# EAGLE design headphone_vu_schematic (EAGLE 7.2.0)
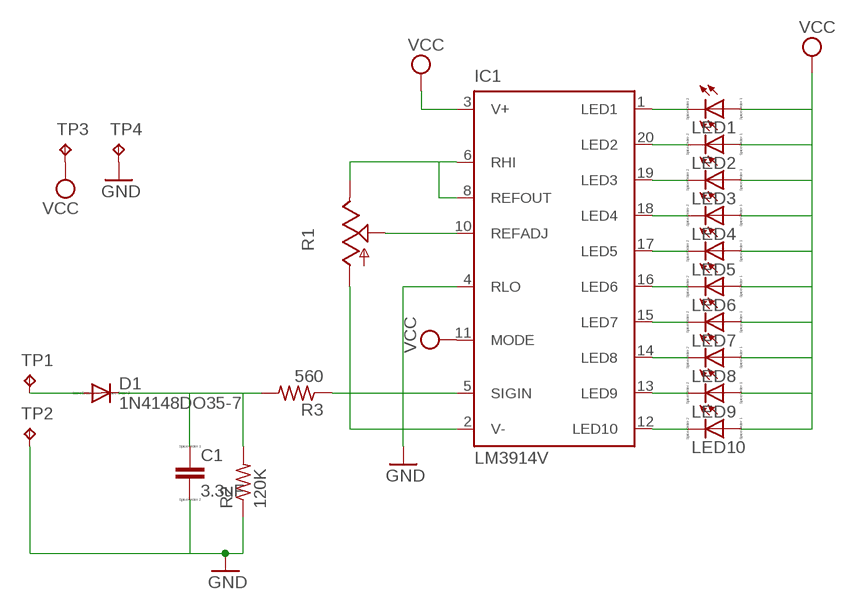
[diagram p0: schematic, sheet 1]

## Parts
C1  3.3uF  CC0603  [C0603]
D1  1N4148DO35-7  [DO35-7]
IC1  LM3914V  [PLCC20S]
LED1  LED_E  [LED_1206]
LED2  LED_E  [LED_1206]
LED3  LED_E  [LED_1206]
LED4  LED_E  [LED_1206]
LED5  LED_E  [LED_1206]
LED6  LED_E  [LED_1206]
LED7  LED_E  [LED_1206]
LED8  LED_E  [LED_1206]
LED9  LED_E  [LED_1206]
LED10  LED_E  [LED_1206]
R1  TRIM_US-3223W  [3223W]
R2  120K  R-US_R0603  [R0603]
R3  560  R-US_R0603  [R0603]
TP1  TPPAD1-20  [P1-20]
TP2  TPPAD1-20  [P1-20]
TP3  TPPAD1-20  [P1-20]
TP4  TPPAD1-20  [P1-20]

## Nets
GND: C1.2 IC1.2(V-) IC1.4(RLO) R1.1(A) R2.1 TP2.TP TP4.TP
N$1: IC1.1(LED1) LED1.C
N$2: IC1.20(LED2) LED2.C
N$3: IC1.19(LED3) LED3.C
N$4: IC1.18(LED4) LED4.C
N$5: IC1.17(LED5) LED5.C
N$6: IC1.16(LED6) LED6.C
N$7: IC1.15(LED7) LED7.C
N$8: IC1.14(LED8) LED8.C
N$9: IC1.13(LED9) LED9.C
N$10: IC1.12(LED10) LED10.C
N$11: IC1.6(RHI) IC1.8(REFOUT) R1.3(E)
N$12: IC1.10(REFADJ) R1.2(S)
N$13: C1.1 D1.C R2.2 R3.2
N$15: IC1.5(SIGIN) R3.1
N$16: D1.A TP1.TP
VCC: IC1.3(V+) IC1.11(MODE) LED1.A LED2.A LED3.A LED4.A LED5.A LED6.A LED7.A LED8.A LED9.A LED10.A TP3.TP

## Library data of the parts
C1 = eagle-ltspice:C: CAPACITOR, European symbol; SPICEMODEL: NONE; SPICEPREFIX: C
D1 = diode:1N4148: DIODE high speed (Philips)
IC1 = national-semiconductor:LM391: Dot/Bar Display Driver Source: Data sheet LM3915 <http://www.national.com/ds/LM/LM3915.pdf> Data sheet LM3914 <http://www.national.com/ds/LM/LM3914.pdf>
LED1-LED10 = eagle-ltspice:LED_E: LED Source: http://www.osram.convergy.de Source: www.luxeon.com Source: www.kingbright.com; SPICEMODEL: NONE; SPICEPREFIX: D; SPICETYPE: diode
R1 = pot:TRIM_US-: POTENTIOMETER
R2 R3 = resistor:R-US_: RESISTOR, American symbol
TP1-TP4 = testpad:TP: Test pad

## Board
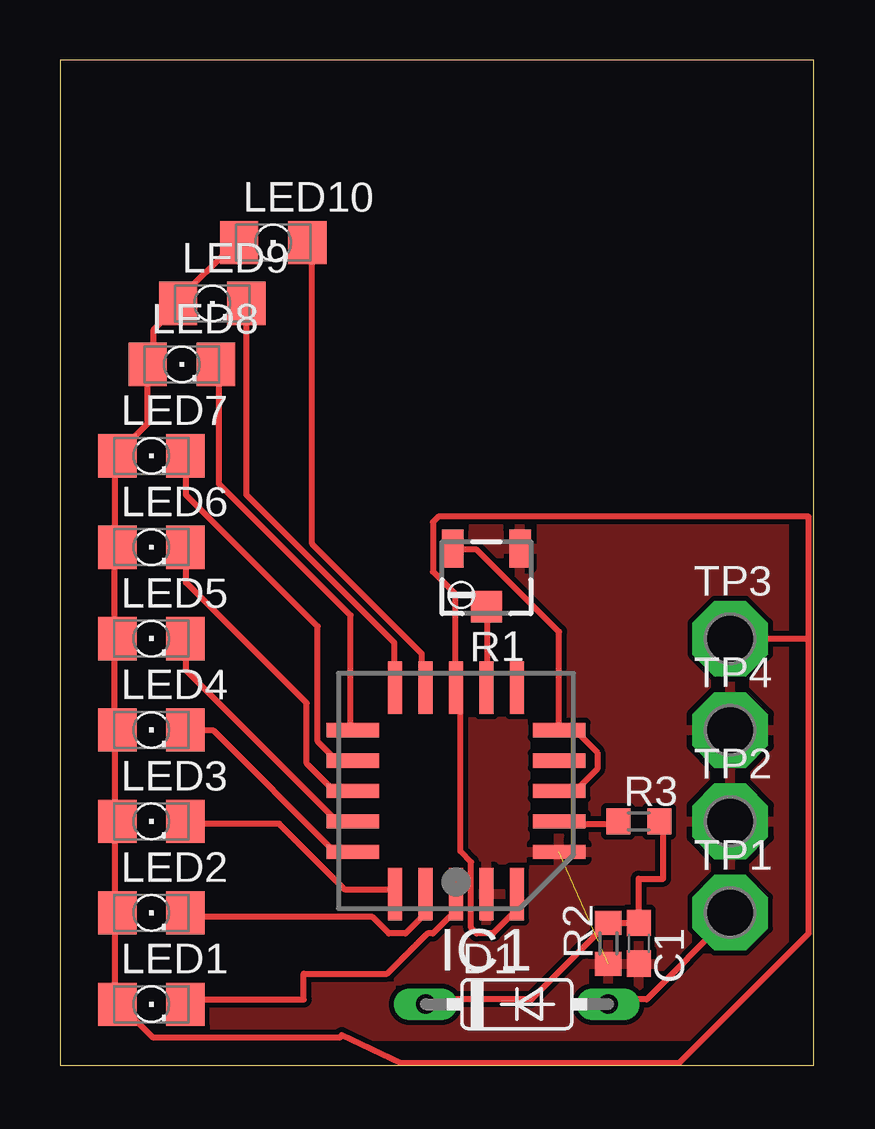
[diagram p1: board, top side]

Size 31.42 x 41.9 mm. Coordinates in mm from the lower left corner, seen from the top.
Outline: 0,0 31.42,0 31.42,41.9 0,41.9 0,0
Copper layers (1*16): Top 0.035mm / dielectric 1.5mm / Bottom 0.035mm
Design rules "default": minimum track width 10mil, minimum drill 24mil, track to track 8mil, track to pad 8mil, pad to pad 8mil, via to via 8mil, smd to smd 8mil, copper to edge 40mil, drill to drill 8mil, minimum pad ring 10mil, minimum via ring 8mil, stop-mask expansion 4mil, vias tented up to drill 0mil, thermal gap 10mil

### Footprints (pad centres in the part's own frame; a part is rotated, then mirrored left to right if it is on the bottom)
C0603 = smd 1.1 x 1: 1 -0.85,0; 2 0.85,0
DO35-7 = drill 0.813 long: A 3.81,0; C -3.81,0
PLCC20S = smd 0.6 x 2.2: 1 0,4.3; 2 -1.27,4.3; 3 -2.54,4.3; 9 -2.54,-4.3; 10 -1.27,-4.3; 11 0,-4.3; 12 1.27,-4.3; 13 2.54,-4.3; 19 2.54,4.3; 20 1.27,4.3 | smd 2.2 x 0.6: 4 -4.3,2.54; 5 -4.3,1.27; 6 -4.3,0; 7 -4.3,-1.27; 8 -4.3,-2.54; 14 4.3,-2.54; 15 4.3,-1.27; 16 4.3,0; 17 4.3,1.27; 18 4.3,2.54
LED_1206 = smd 1.6 x 1.803: A -1.422,0; C 1.422,0
3223W = smd 0.9 x 1.6: 1 -1.4,-1.215; 3 1.4,-1.215 | smd 1.3 x 1.3: 2 0,1.215
R0603 = smd 1 x 1.1: 1 -0.85,0; 2 0.85,0
P1-20 = drill 2.007 pad 3.15 octagon: TP 0,0

### Placement (x,y rotation side)
C1  24.13,5.08 270 top
D1  19.05,2.54 0 top
IC1  16.51,11.43 180 top
LED1  3.81,2.54 0 top
LED2  3.81,6.35 0 top
LED3  3.81,10.16 0 top
LED4  3.81,13.97 0 top
LED5  3.81,17.78 0 top
LED6  3.81,21.59 0 top
LED7  3.81,25.4 0 top
LED8  5.08,29.21 0 top
LED9  6.35,31.75 0 top
LED10  8.89,34.29 0 top
R1  17.78,20.32 180 top
R2  22.86,5.08 90 top
R3  24.13,10.16 0 top
TP1  27.94,6.35 0 top
TP2  27.94,10.16 0 top
TP3  27.94,17.78 0 top
TP4  27.94,13.97 0 top

### Tracks (layer width: path | path; a pad name or v marks a point on that pad's centre or on a via)
GND  (1 unrouted)
  pour Top: 0,0 0,24.13 arc-67 10.16,39.37 13.97,39.37 13.97,24.13 30.48,24.13 30.48,0
N$1
  Top 0.254: LED1.C 5.26,2.74 10.16,2.74 10.16,3.81 13.64,3.81 15.32,5.49 15.54,5.49 16.46,6.4 16.46,7.09 IC1.1
N$2
  Top 0.254: LED2.C 5.26,6.17 13.03,6.17 13.72,5.49 14.4,5.49 15.09,6.17 15.09,7.09 IC1.20
N$3
  Top 0.254: LED3.C 5.26,10.06 9.14,10.06 11.89,7.32 13.95,7.32 IC1.19
N$4
  Top 0.254: LED4.C 5.26,13.95 6.4,13.95 11.43,8.91 12.12,8.91 IC1.18
N$5
  Top 0.254: LED5.C 5.26,17.6 5.26,16.46 11.43,10.29 12.12,10.29 IC1.17
N$6
  Top 0.254: IC1.16 11.43,11.43 10.29,12.57 10.29,15.09 5.26,20.12 5.26,21.49 LED6.C
N$7
  Top 0.254: LED7.C 5.26,25.38 5.26,23.77 10.74,18.29 10.74,13.49 11.43,12.8 12.12,12.8 IC1.15
N$8
  Top 0.254: LED8.C 6.63,29.03 6.63,24.23 12.12,18.75 12.12,14.17 IC1.14
N$9
  Top 0.254: LED9.C 7.77,31.55 7.77,23.77 13.95,17.6 13.95,15.77 IC1.13
N$10
  Top 0.254: LED10.C 10.52,34.29 10.52,21.72 15.09,17.14 15.09,15.77 IC1.12
N$11
  Top 0.254: R1.3 16.46,21.49 17.37,21.49 20.8,18.06 20.8,14.17 IC1.8 21.03,13.95 21.49,13.95 22.4,13.03 22.4,12.34 21.49,11.43 IC1.6
N$12
  Top 0.254: R1.2 17.83,18.97 17.83,15.77 IC1.10
N$13
  Top 0.254: D1.C 15.32,2.74 19.66,2.74 22.86,5.94 R2.2 C1.1 24.13,7.77 25.15,7.77 25.15,10.06 R3.2
N$15
  Top 0.254: R3.1 23.09,10.06 21.03,10.06 IC1.5
N$16
  Top 0.254: D1.A 22.86,2.74 24.46,2.74 27.89,6.17 TP1.TP
VCC
  Top 0.254: IC1.3 18.97,7.09 18.97,6.4 18.06,5.49 17.37,5.49 17.14,5.71 17.14,8.46 16.69,8.91 16.69,15.54 IC1.11 16.46,15.77 16.46,19.66 15.54,20.57 15.54,22.63 15.77,22.86 31.22,22.86 31.22,17.78 | LED10.A 7.32,34.29 4.8,31.77 LED9.A 4.8,31.55 3.89,30.63 3.89,29.26 LED8.A 3.66,29.03 3.66,26.75 2.52,25.6 LED7.A 2.29,25.38 2.29,21.72 LED6.A 2.29,21.49 2.29,17.83 LED5.A 2.29,17.6 2.29,14.17 LED4.A 2.29,13.95 2.29,10.29 LED3.A 2.29,10.06 2.29,6.4 LED2.A 2.29,6.17 2.29,2.74 LED1.A 2.52,2.52 3.89,1.14 11.66,1.14 11.76,1.25 14.17,0.1 25.83,0.1 31.22,5.49 31.22,17.78 | TP3.TP 31.22,17.78